# Altium project jz_work0.5.PrjPCB
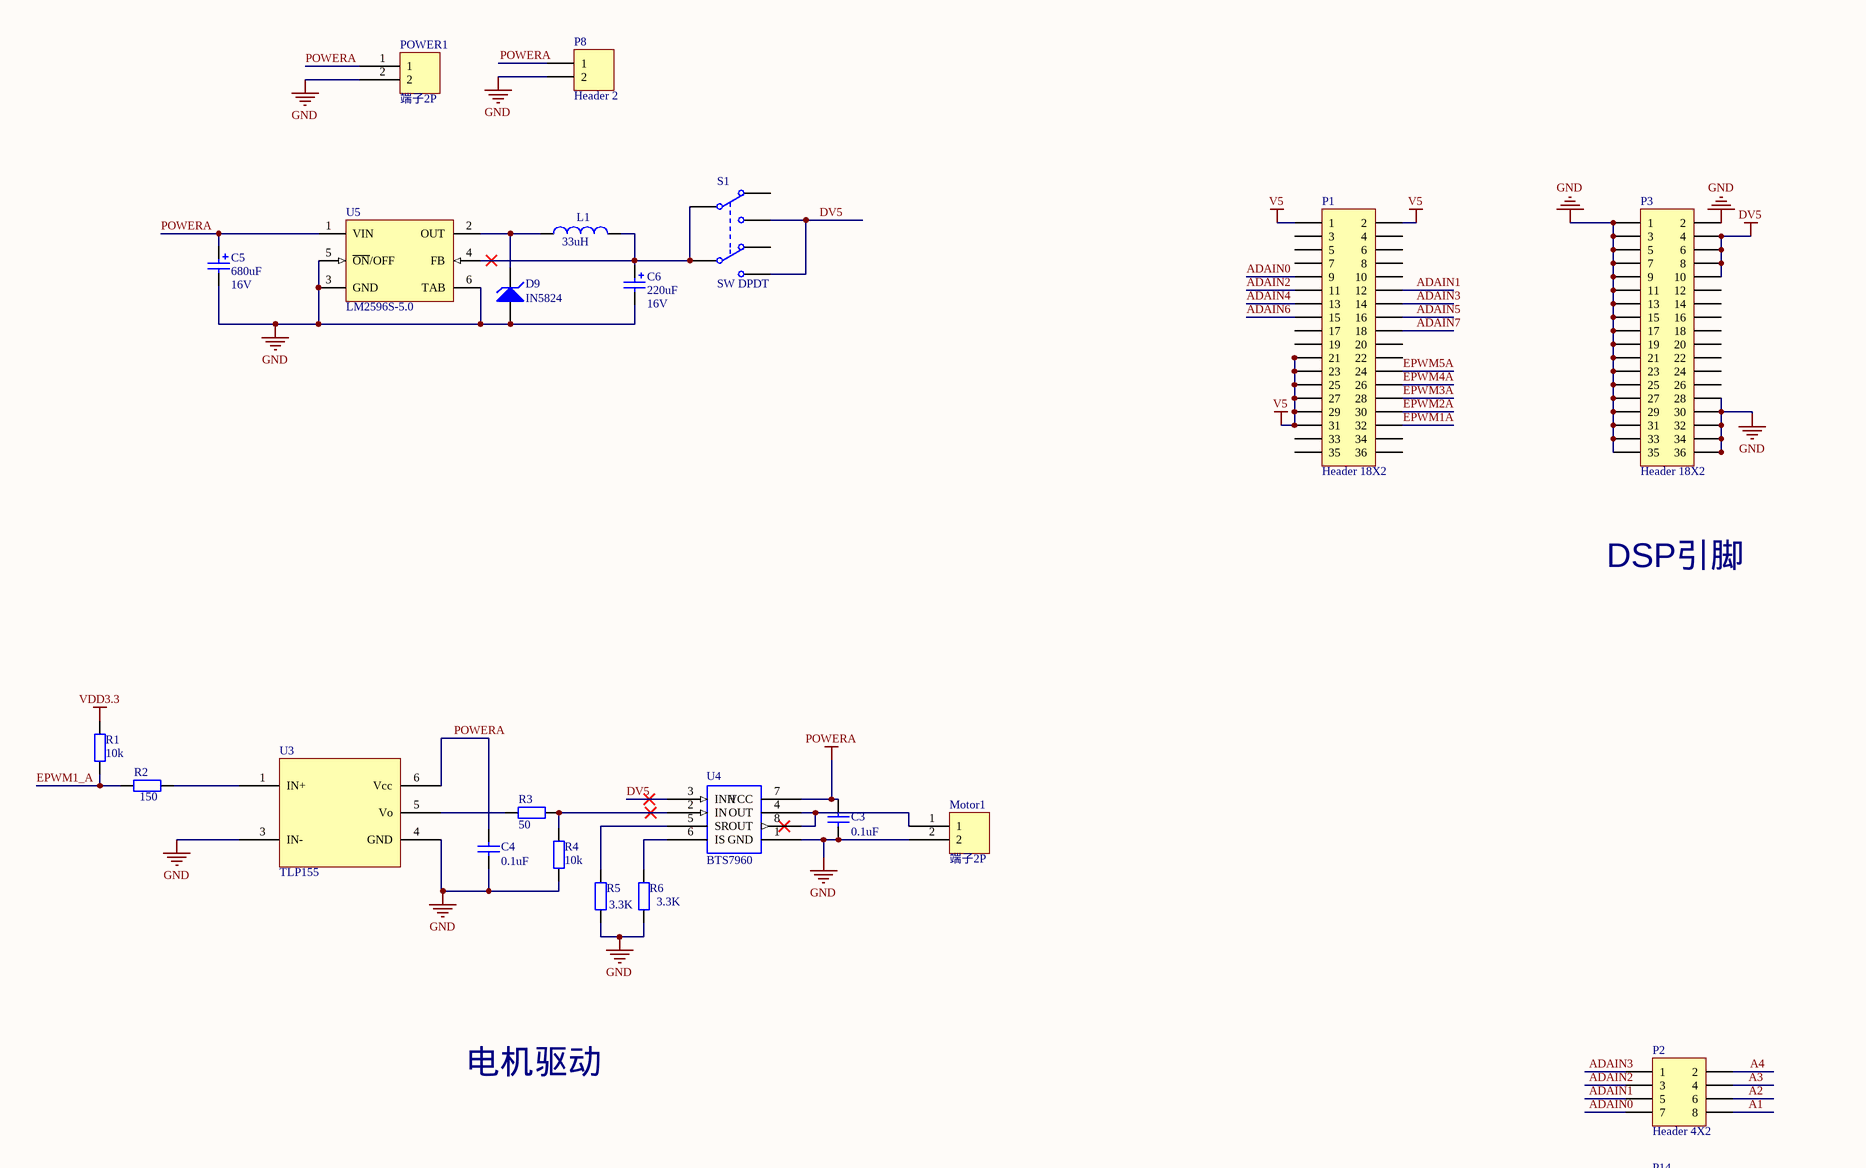
[diagram p0: 假肢工作电路.SchDoc, top left]
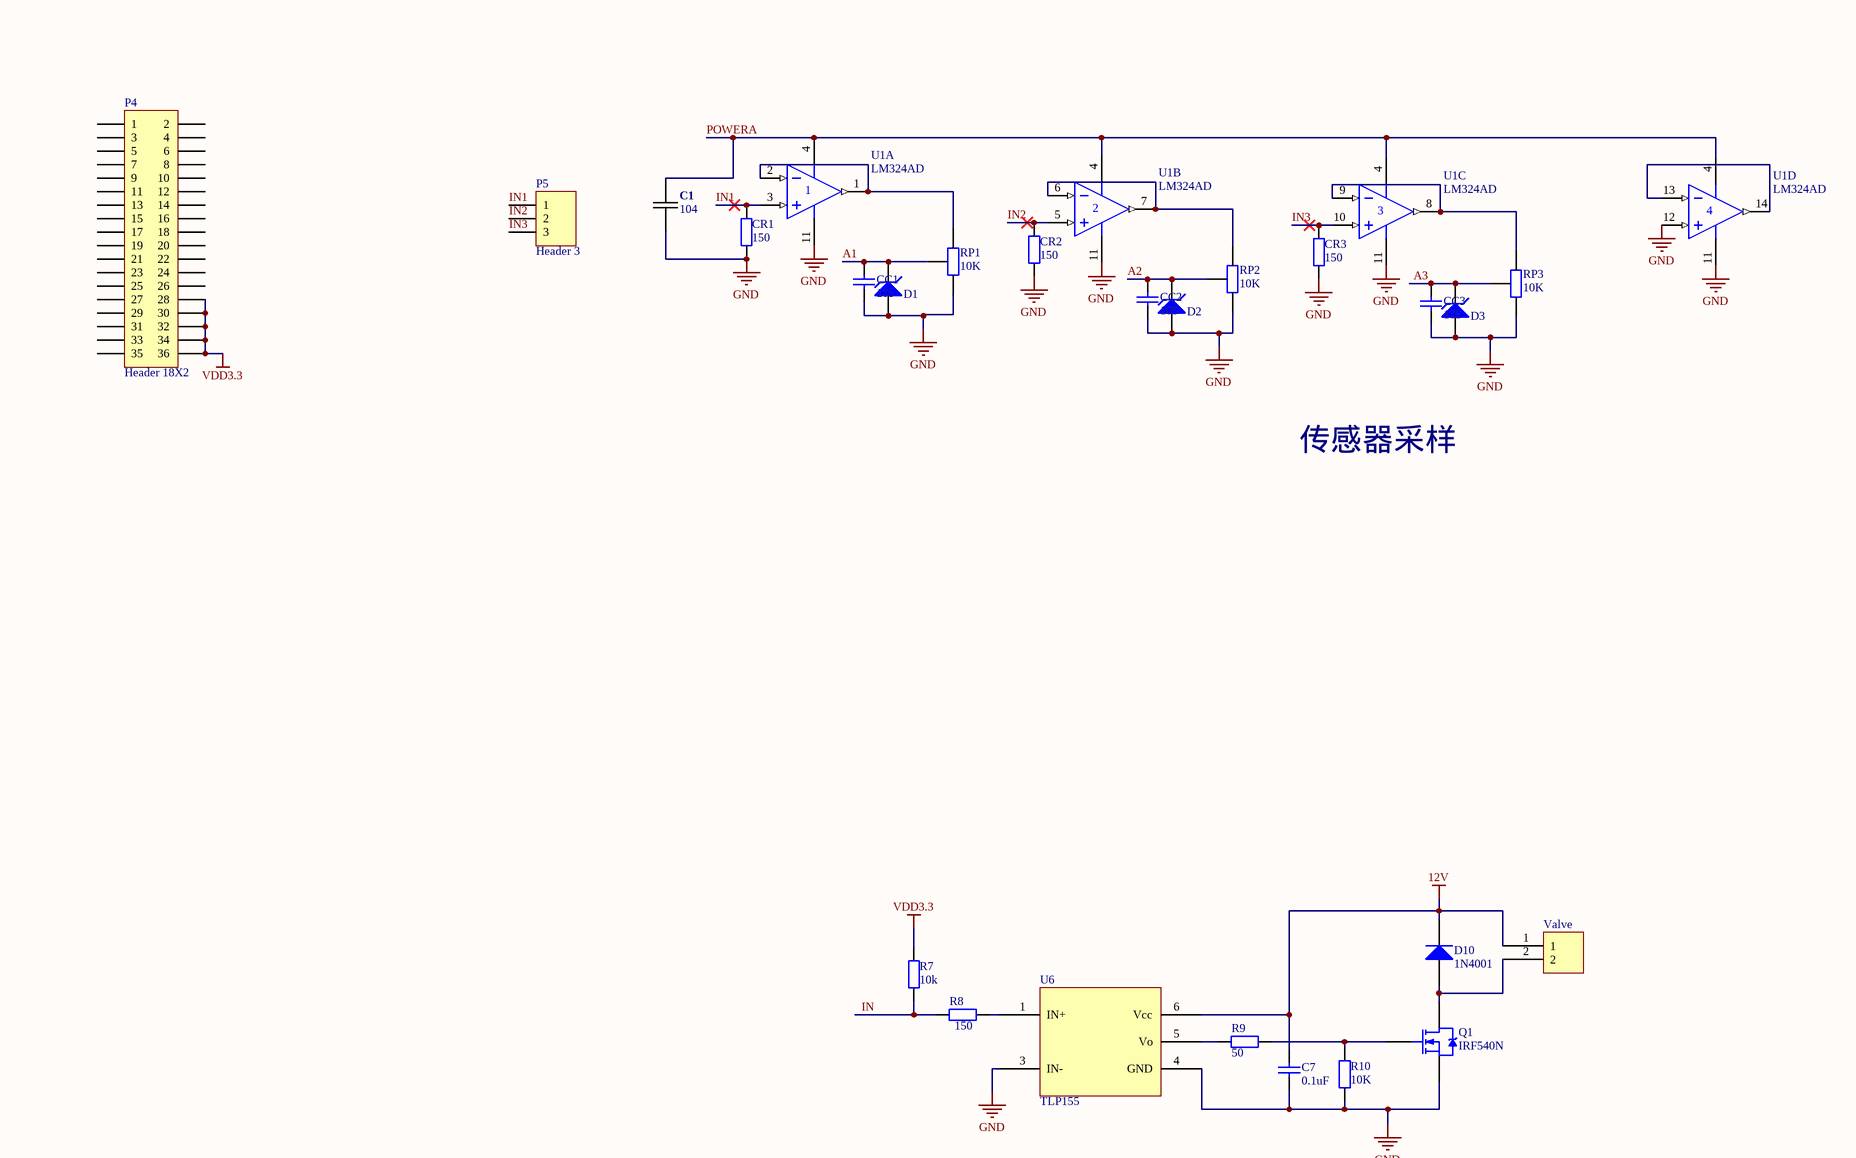
[diagram p1: 假肢工作电路.SchDoc, top right]
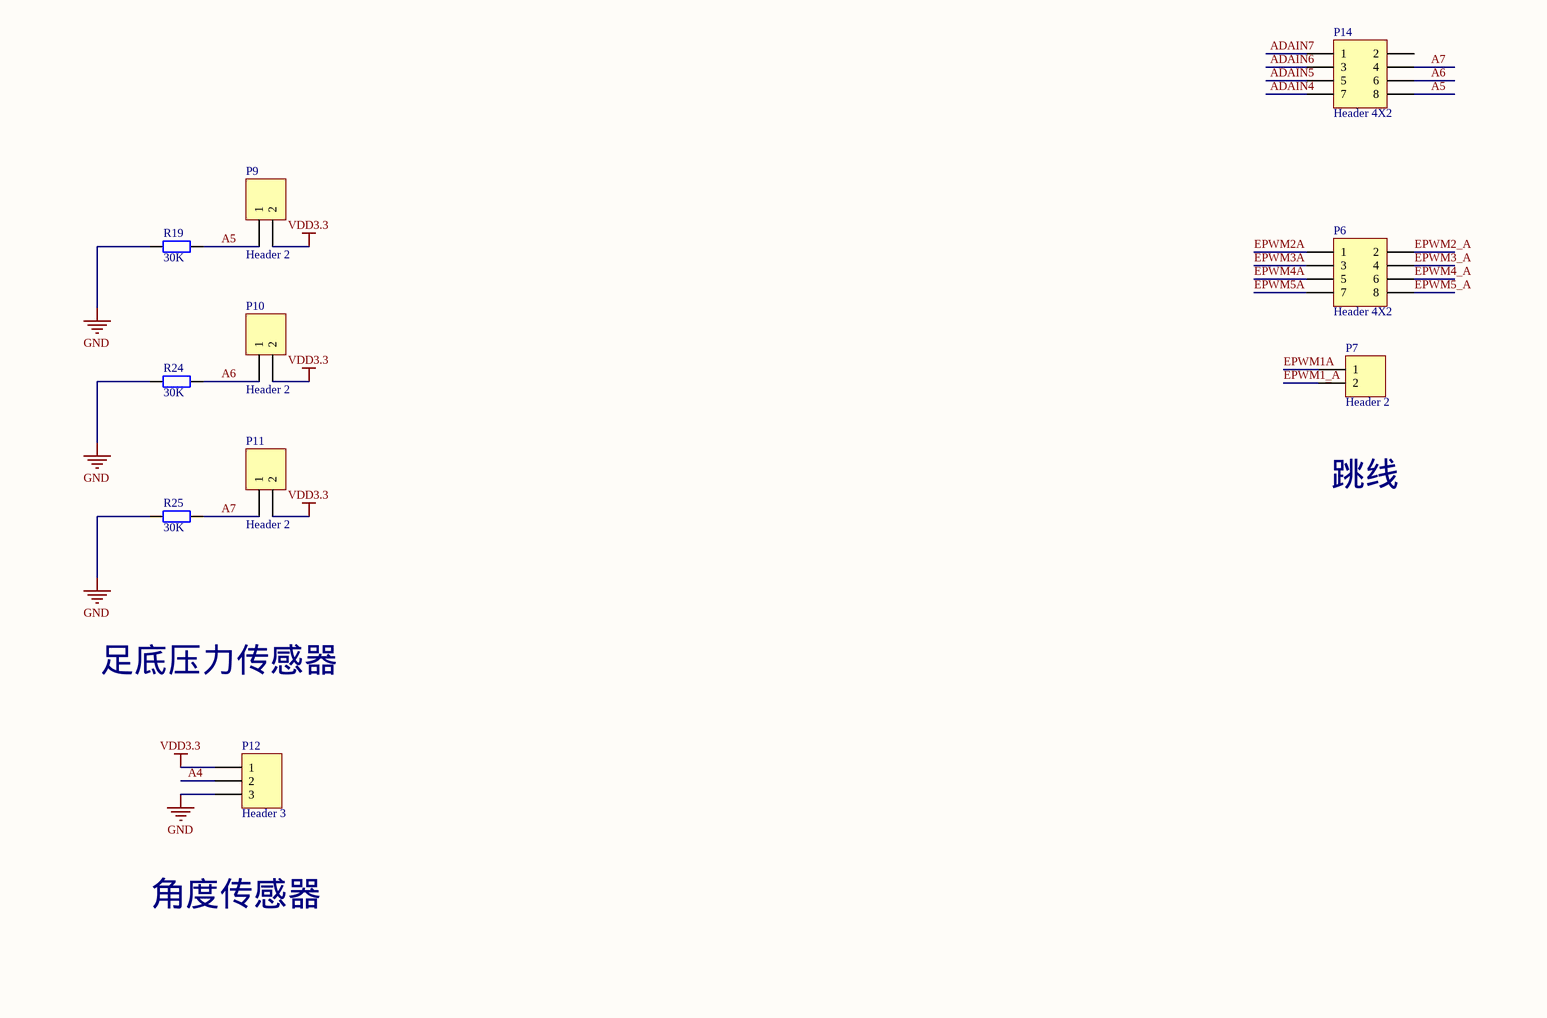
[diagram p2: 假肢工作电路.SchDoc, bottom left]
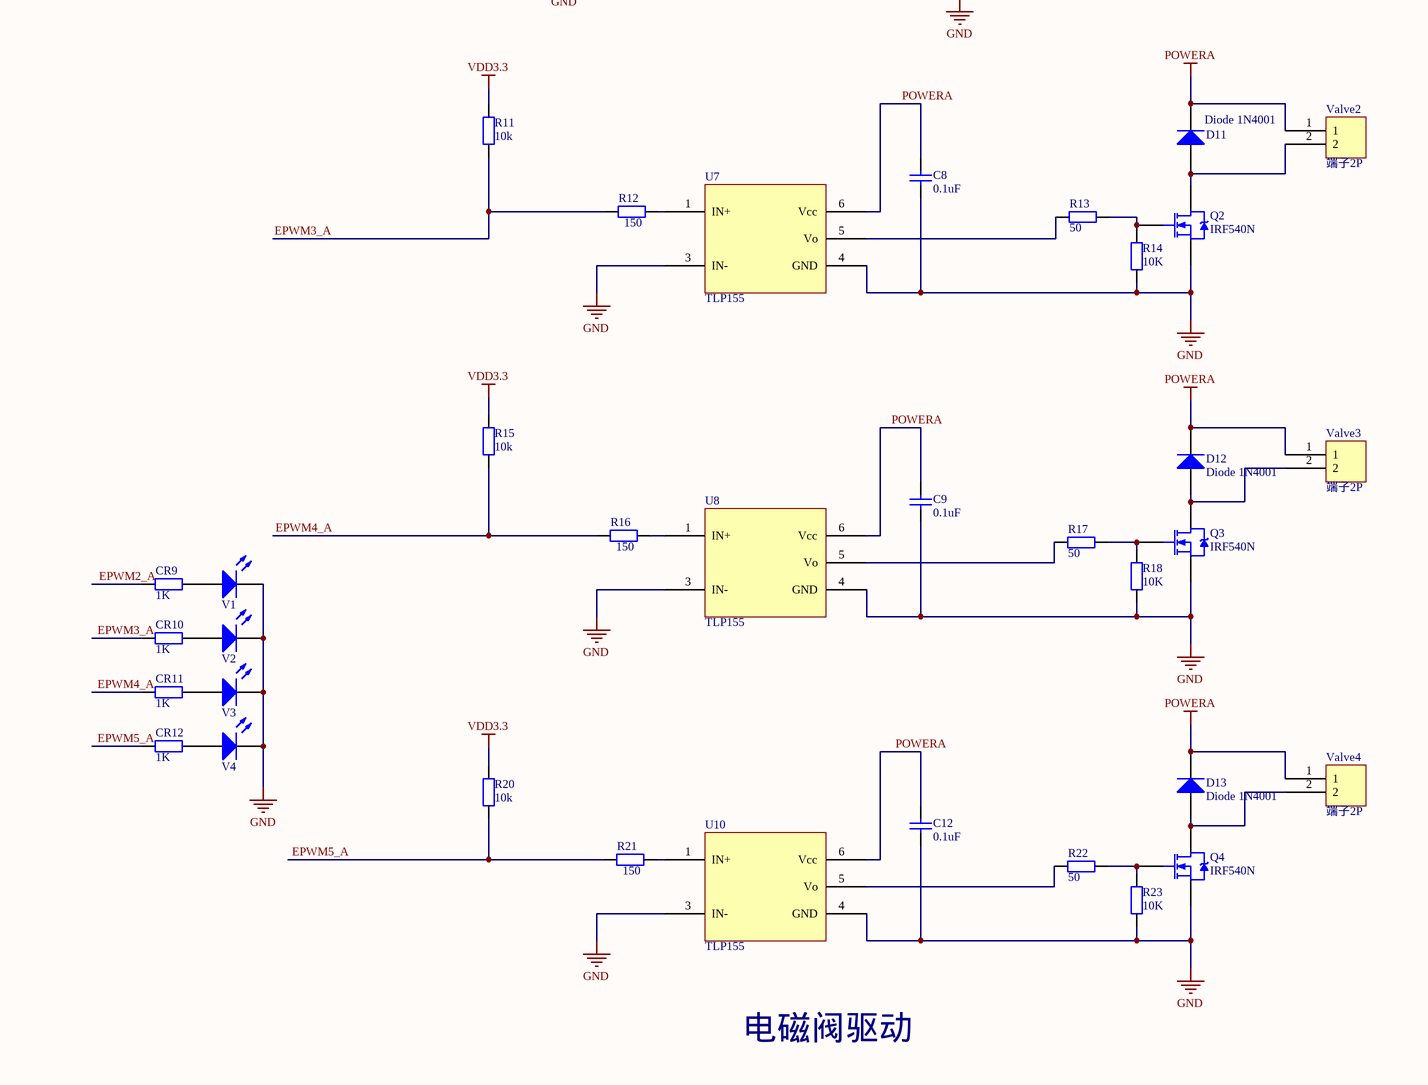
[diagram p3: 假肢工作电路.SchDoc, bottom right]
1 sheet, 92 parts. Net scope: global (net labels, ports and power ports of the same name join across sheets).
Board file: jz_dlt0.5.PcbDoc

## Sheet 假肢工作电路.SchDoc
size A1

### Parts
C1  104  [LC-0805_C]
C3  0.1uF  [LC-0805_C]
C4  0.1uF  [LC-0805_C]
C5  value 680uF  Voltage: 16V  [SMD-EC-F10]  (hidden comment: 10uF,16V)
C6  value 220uF  Voltage: 16V  [SMD-EC-F8]  (hidden comment: 10uF,16V)
C7  0.1uF  [LC-0805_C]
C8  0.1uF  [LC-0805_C]
C9  0.1uF  [LC-0805_C]
C12  0.1uF  [LC-0805_C]
CC1  105  [LC-0805_C]
CC2  105  [LC-0805_C]
CC3  105  [LC-0805_C]
CR1  150  [LC-0805_R]
CR2  150  [LC-0805_R]
CR3  150  [LC-0805_R]
CR9  1K  [LC-0805_R]
CR10  1K  [LC-0805_R]
CR11  1K  [LC-0805_R]
CR12  1K  [LC-0805_R]
D1  Diode  Zener  [LC-1206]  (value not drawn)
D2  Diode  Zener  [LC-1206]  (value not drawn)
D3  Diode  Zener  [LC-1206]  (value not drawn)
D9  IN5824  [LC-1206]
D10  1N4001  [DO-41]
D11  Diode 1N4001  [DO-41]
D12  Diode 1N4001  [DO-41]
D13  Diode 1N4001  [DO-41]
L1  value 33uH  [SMD-EC-F10]  (hidden comment: Inductor)
Motor1  端子2P  [DUANZI2P]
P1  Header 18X2  [HDR2X18]
P2  Header 4X2  [HDR2X4]
P3  Header 18X2  [HDR2X18]
P4  Header 18X2  [HDR2X18]
P5  Header 3  [XH2.54-3]
P6  Header 4X2  [HDR2X4]
P7  Header 2  [HDR1X2]
P8  Header 2  [XH2.54-2]
P9  Header 2  [XH2.54-2]
P10  Header 2  [XH2.54-2]
P11  Header 2  [XH2.54-2]
P12  Header 3  [XH2.54-3]
P14  Header 4X2  [HDR2X4]
POWER1  端子2P  [DUANZI2P]
Q1  IRF540N  [TO-220AB]
Q2  IRF540N  [TO-220AB]
Q3  IRF540N  [TO-220AB]
Q4  IRF540N  [TO-220AB]
R1  10k  [LC-0805_R]
R2  150  [LC-0805_R]
R3  50  [LC-0805_R]
R4  10k  [LC-0805_R]
R5  3.3K  [LC-0805_R]
R6  3.3K  [LC-0805_R]
R7  10k  [LC-0805_R]
R8  150  [LC-0805_R]
R9  50  [LC-0805_R]
R10  10K  [LC-0805_R]
R11  10k  [LC-0805_R]
R12  150  [LC-0805_R]
R13  50  [LC-0805_R]
R14  10K  [LC-0805_R]
R15  10k  [LC-0805_R]
R16  150  [LC-0805_R]
R17  50  [LC-0805_R]
R18  10K  [LC-0805_R]
R19  value 30K  [AXIAL-0.4]  (hidden comment: 3.3K)
R20  10k  [LC-0805_R]
R21  150  [LC-0805_R]
R22  50  [LC-0805_R]
R23  10K  [LC-0805_R]
R24  value 30K  [AXIAL-0.4]  (hidden comment: 3.3K)
R25  value 30K  [AXIAL-0.4]  (hidden comment: 3.3K)
RP1  10K  [VR5]
RP2  10K  [VR5]
RP3  10K  [VR5]
S1  SW DPDT  [AN88]
U1  LM324AD  [SO-14]  (parts A,B,C,D of 4)
U3  TLP155  [so6]
U4  BTS7960  [BTS7960]
U5  LM2596S-5.0  [TS5B_N]
U6  TLP155  [so6]
U7  TLP155  [so6]
U8  TLP155  [so6]
U10  TLP155  [so6]
V1  LED Chip  [CLED2012-0805]  (value not drawn)
V2  LED Chip  [CLED2012-0805]  (value not drawn)
V3  LED Chip  [CLED2012-0805]  (value not drawn)
V4  LED Chip  [CLED2012-0805]  (value not drawn)
Valve  (no value)  [DUANZI2P]
Valve2  端子2P  [DUANZI2P]
Valve3  端子2P  [DUANZI2P]
Valve4  端子2P  [DUANZI2P]

### Nets
12V: C7.1 D10.2(K) U6.6(Vcc) Valve.1
DV5: P3.4 P3.6 P3.8 P3.10 S1.3(NO1) S1.6(NO2) U4.3(INH)
GND: C1.2 C3.2 C4.2 C5.2 C6.2 C7.2 C8.2 C9.2 C12.2 CC1.1 CC2.1 CC3.1 CR1.2 CR2.2 CR3.2 D1.1(A) D2.1(A) D3.1(A) D9.1(A) Motor1.2 P3.1 P3.2 P3.3 P3.5 P3.7 P3.9 P3.11 P3.13 P3.15 P3.17 P3.19 P3.21 P3.23 P3.25 P3.27 P3.28 P3.29 P3.30 P3.31 P3.32 P3.33 P3.34 P3.35 P3.36 P8.2 P12.3 POWER1.2 Q1.3(S) Q2.3(S) Q3.3(S) Q4.3(S) R4.1 R5.1 R6.1 R10.1 R14.1 R18.1 R19.2 R23.1 R24.2 R25.2 RP1.1 RP2.1 RP3.1 U1.11(V-) U1.12(IN+) U3.3(IN-) U3.4(GND) U4.1(GND) U5.3(GND) U5.5(~{ON}/OFF) U5.6(TAB) U6.3(IN-) U6.4(GND) U7.3(IN-) U7.4(GND) U8.3(IN-) U8.4(GND) U10.3(IN-) U10.4(GND) V1.2(K) V2.2(K) V3.2(K) V4.2(K)
POWERA: C1.1 C3.1 C4.1 C5.1 C8.1 C9.1 C12.1 D11.2(K) D12.2(K) D13.2(K) P8.1 POWER1.1 U1.4(V+) U3.6(Vcc) U4.7(VCC) U5.1(VIN) U7.6(Vcc) U8.6(Vcc) U10.6(Vcc) Valve2.1 Valve3.1 Valve4.1
V5: P1.1 P1.2 P1.21 P1.23 P1.25 P1.27 P1.29 P1.31
VDD3.3: P4.28 P4.30 P4.32 P4.34 P4.36 P9.2 P10.2 P11.2 P12.1 R1.2 R7.2 R11.2 R15.2 R20.2
A1: CC1.2 D1.2(K) P2.8 RP1.2
A2: CC2.2 D2.2(K) P2.6 RP2.2
A3: CC3.2 D3.2(K) P2.4 RP3.2
A4: P2.2 P12.2
A5: P9.1 P14.8 R19.1
A6: P10.1 P14.6 R24.1
A7: P11.1 P14.4 R25.1
ADAIN0: P1.9 P2.7
ADAIN1: P1.12 P2.5
ADAIN2: P1.11 P2.3
ADAIN3: P1.14 P2.1
ADAIN4: P1.13 P14.7
ADAIN5: P1.16 P14.5
ADAIN6: P1.15 P14.3
ADAIN7: P1.18 P14.1
EPWM1_A: P7.2 R1.1 R2.1
EPWM1A: P1.32 P7.1
EPWM2_A: CR9.1 P6.2
EPWM2A: P1.30 P6.1
EPWM3_A: CR10.1 P6.4 R11.1 R12.1
EPWM3A: P1.28 P6.3
EPWM4_A: CR11.1 P6.6 R15.1 R16.1
EPWM4A: P1.26 P6.5
EPWM5_A: CR12.1 P6.8 R20.1 R21.1
EPWM5A: P1.24 P6.7
IN: R7.1 R8.1
IN1: CR1.1 P5.1 U1.3(IN+)
IN2: CR2.1 P5.2 U1.5(IN+)
IN3: CR3.1 P5.3 U1.10(IN+)
NetC6_1: C6.1 L1.2 S1.1(COMMON1) S1.5(COMMON2) U5.4(FB)
NetCR9_2: CR9.2 V1.1(A)
NetCR10_2: CR10.2 V2.1(A)
NetCR11_2: CR11.2 V3.1(A)
NetCR12_2: CR12.2 V4.1(A)
NetD9_2: D9.2(K) L1.1 U5.2(OUT)
NetD10_1: D10.1(A) Q1.2(D) Valve.2
NetD11_1: D11.1(A) Q2.2(D) Valve2.2
NetD12_1: D12.1(A) Q3.2(D) Valve3.2
NetD13_1: D13.1(A) Q4.2(D) Valve4.2
NetMotor1_1: Motor1.1 U4.4(OUT) U4.8(OUT)
NetQ1_1: Q1.1(G) R9.2 R10.2
NetQ2_1: Q2.1(G) R13.2 R14.2
NetQ3_1: Q3.1(G) R17.2 R18.2
NetQ4_1: Q4.1(G) R22.2 R23.2
NetR2_2: R2.2 U3.1(IN+)
NetR3_1: R3.1 U3.5(Vo)
NetR3_2: R3.2 R4.2 U4.2(IN)
NetR5_2: R5.2 U4.5(SR)
NetR6_2: R6.2 U4.6(IS)
NetR8_2: R8.2 U6.1(IN+)
NetR9_1: R9.1 U6.5(Vo)
NetR12_2: R12.2 U7.1(IN+)
NetR13_1: R13.1 U7.5(Vo)
NetR16_2: R16.2 U8.1(IN+)
NetR17_1: R17.1 U8.5(Vo)
NetR21_2: R21.2 U10.1(IN+)
NetR22_1: R22.1 U10.5(Vo)
NetRP1_3: RP1.3 U1.1(OUT) U1.2(IN-)
NetRP2_3: RP2.3 U1.6(IN-) U1.7(OUT)
NetRP3_3: RP3.3 U1.8(OUT) U1.9(IN-)
NetU1_13: U1.13(IN-) U1.14(OUT)

Not connected (* = marked no-connect by the designer): P1 3 4 5 6 7 8 10 17 19 20 22 33 34 35 36; P3 12 14 16 18 20 22 24 26; P4 1 2 3 4 5 6 7 8 9 10 11 12 13 14 15 16 17 18 19 20 21 22 23 24 25 26 27 29 31 33 35; P14 2; S1 2(NC1) 4(NC2)

### Notes on the sheet
- DSP引脚
- 传感器采样
- 电机驱动
- 跳线
- 足底压力传感器
- 角度传感器
- 电磁阀驱动

### Library data of the parts
C1 = CAP(瓷片,104): 1.02.08.0014
C3 C4 C7-C9 C12 = Cap: Capacitor; Published: 8-Jun-2000; LatestRevisionDate: 17-Jul-2002; LatestRevisionNote: Re-released for DXP Platform.; PackageReference: RAD-0.3; Publisher: Altium Limited; PackageDescription: Radial Cap, Thru-Hole; 2 Leads; 0.3 in Pin Spacing; Value: 0.1uF
C5 C6 = Cap Pol 2x5: Polarized Capacitor (Radial); Published: 8-Jun-2000; Revision: July-2002: Re-released for DXP Platform.; Publisher: Altium Limited
CC1-CC3 = Cap Chip 0805: Polarized Capacitor (Radial); Published: 8-Jun-2000; Revision: July-2002: Re-released for DXP Platform.; Publisher: Altium Limited; Value: 105
CR1-CR3 CR9-CR12 = Resistor Chip 0805: Resistor; Published: 8-Jun-2000; Revision: July-2002: Re-released for DXP Platform.; Publisher: Altium Limited
  CR1-CR3: Value: 150
  CR9-CR12: Value: 1K
D1-D3 D9 = Diode  Zener: Zener Diode; Published: 8-Jun-2000; Revision: July-2002: Re-released for DXP Platform.; Publisher: Altium Limited
D10-D13 = Diode 1N4001: 1 Amp General Purpose Rectifier; Published: 8-Jun-2000; LatestRevisionDate: 17-Jul-2002; LatestRevisionNote: Re-released for DXP Platform.; DatasheetVersion: 1998; PackageVersion: Aug-1999; PackageReference: DO-41; Publisher: Altium Limited; PackageDescription: Diode, Axial; Body 5.2 x 2.7 mm (LxDia. max), Lead Dia. 0.86 mm (max); Code_JEDEC: DO-204-AL; ComponentLink1Description: Manufacturer Link; ComponentLink1URL: http://www.fairchildsemi.com/; ComponentLink2Description: Datasheet; ComponentLink2URL: http://www.fairchildsemi.com/ds/1N%2F1N4001.pdf
L1 = Inductor: Code_IEC: 1005; Published: 8-Jun-2000; LatestRevisionDate: 29-May-2009; LatestRevisionNote: IPC-7351 Footprint Added.; PackageReference: 0402-A; Publisher: Altium Limited; PackageDescription: Chip Inductor; Code_JEITA: 0402
Motor1 POWER1 Valve Valve2-Valve4 = DUANZI2: pin to pad: 1>0 2>1
P1 P3 P4 = Header 18X2: Header, 18-Pin, Dual row; LatestRevisionDate: 17-Jul-2002; LatestRevisionNote: Re-released for DXP Platform.; Publisher: Altium Limited
P2 P6 P14 = Header 4X2: Header, 4-Pin, Dual row; LatestRevisionDate: 17-Jul-2002; LatestRevisionNote: Re-released for DXP Platform.; Publisher: Altium Limited
P5 P12 = Header 3: Header, 3-Pin; LatestRevisionDate: 17-Jul-2002; LatestRevisionNote: Re-released for DXP Platform.; Publisher: Altium Limited
P7-P11 = Header 2: Header, 2-Pin; LatestRevisionDate: 17-Jul-2002; LatestRevisionNote: Re-released for DXP Platform.; Publisher: Altium Limited
Q1-Q4 = IRF540N: HEXFET Power MOSFET; Note: Pin 2 is electrically connected to pin 4.; Sim Note: Thermal Model provided is not called on from main Subckt.; Published: 8-Jun-2000; LatestRevisionDate: 17-Jul-2002; LatestRevisionNote: Re-released for DXP Platform.; DatasheetVersion: May-1998; PackageVersion: Feb-1997; PackageReference: TO-220AB; Publisher: Altium Limited; PackageDescription: TO, Thru-Hole, Vertical, Heatsink Mounted; 3 In-Line Leads; Pitch 2.54 mm; ComponentLink1Description: Manufacturer Link; ComponentLink1URL: http://www.irf.com/; ComponentLink2Description: Datasheet; ComponentLink2URL: http://www.irf.com/product-info/datasheets/data/irf540n.pdf
R1-R25 = Res2: Resistor; Published: 8-Jun-2000; LatestRevisionDate: 17-Jul-2002; LatestRevisionNote: Re-released for DXP Platform.; PackageReference: AXIAL-0.4; Publisher: Altium Limited; PackageDescription: Axial Device, Thru-Hole; 2 Leads; 0.4 in Pin Spacing
  R1 R4 R7 R11 R15 R20: Value: 10k
  R2 R8 R12 R16 R21: Value: 150
  R3 R9 R13 R17 R22: Value: 50
  R5 R6: Value: 3.3K
  R10 R14 R18 R23: Value: 10K
RP1-RP3 = Res_t
S1 = SW DPDT: Switch; pin to pad: 2>3 3>2 5>6 6>5; Published: 24-Mar-1999; LatestRevisionDate: 29-May-2009; LatestRevisionNote: IPC-7351 Footprint Added.; PackageVersion: Mar-2001; PackageReference: SOT23-6; Publisher: Altium Limited; PackageDescription: 6-Pin SOT-23 Package 0.95 mm Pitch, 2.7 mm Lead Span; Code_JEITA: SC-74; Code_IPC: SOT26A-6
U1 = LM324AD: Quadruple Operational Amplifier; Published: 15-Apr-2002; LatestRevisionDate: 4-Mar-2005; LatestRevisionNote: Stylized 3D Model Added.; DatasheetDocument: Jan-1989; PackageDocument: Jan-1998; PackageReference: D014; Publisher: Altium Limited; ComponentLink1Description: Manufacturer Link; ComponentLink1URL: http://www.ti.com/
U4 = Component_1_1
U5 = LM2596S-5.0: SIMPLE SWITCHER?Power Converter 150 KHz 3A Step-Down Voltage Regulator, 5-pin TO-263; Manufacturer: National Semiconductor; PackageTopMarking: NSUZXYTTE#*LM2596S*-5.0 P+; PowerWise: N; Published: 4-Dec-2008; DatasheetVersion: May-2002; PackageVersion: revD, Apr-2005; PackageReference: TS5B; Publisher: Altium Limited; PackageDescription: TO-263, Molded, .400 x .390 x .180in, 5 Lead, .067in Pitch, Surface Mount; Supplier 1: Farnell; Supplier Part Number 1: 1214546; PartNumber: LM2596S-5.0; RoHS: N; PinCount: 5; CompType: Switcher; Code_JEDEC: MO-169-AB; ComponentLink1Description: LM2596 Datasheet; ComponentLink1URL: http://www.national.com/ds/LM/LM2596.pdf; ComponentLink2Description: LM2596 Web Page; ComponentLink2URL: http://www.national.com/pf/LM/LM2596.html; ComponentLink3Description: TS5B Package Page; ComponentLink3URL: http://www.national.com/packaging/folders/ts5b.html
V1-V4 = LED Chip: Typical Chip LED; Published: 8-Jun-2000; Revision: July-2002: Re-released for DXP Platform.; Publisher: Altium Limited